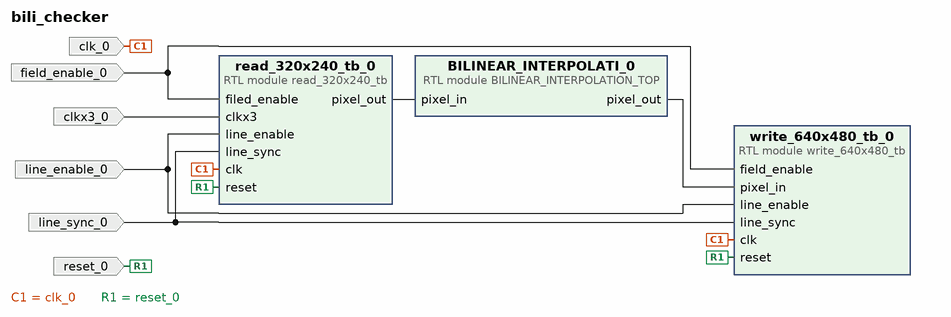
[diagram p0: block diagram of the top level]
# Vivado block design bili_checker, xc7a100tcsg324-1, Vivado 2019.2
create_bd_design bili_checker

create_bd_port -dir I -type clk clk_0
create_bd_port -dir I -type rst reset_0
create_bd_port -dir I field_enable_0
create_bd_port -dir I line_enable_0
create_bd_port -dir I line_sync_0
create_bd_port -dir I clkx3_0

create_bd_cell -type module -reference read_320x240_tb read_320x240_tb_0
create_bd_cell -type module -reference write_640x480_tb write_640x480_tb_0
create_bd_cell -type module -reference BILINEAR_INTERPOLATION_TOP BILINEAR_INTERPOLATI_0

# ---- connections ----

connect_bd_net [get_bd_pins read_320x240_tb_0/pixel_out] [get_bd_pins BILINEAR_INTERPOLATI_0/pixel_in]
connect_bd_net [get_bd_pins BILINEAR_INTERPOLATI_0/pixel_out] [get_bd_pins write_640x480_tb_0/pixel_in]
connect_bd_net -net clk_0_1 [get_bd_ports clk_0] [get_bd_pins write_640x480_tb_0/clk] [get_bd_pins read_320x240_tb_0/clk]
connect_bd_net -net reset_0_1 [get_bd_ports reset_0] [get_bd_pins write_640x480_tb_0/reset] [get_bd_pins read_320x240_tb_0/reset]
connect_bd_net -net field_enable_0_1 [get_bd_ports field_enable_0] \
  [get_bd_pins write_640x480_tb_0/field_enable] [get_bd_pins read_320x240_tb_0/filed_enable]
connect_bd_net -net line_enable_0_1 [get_bd_ports line_enable_0] \
  [get_bd_pins write_640x480_tb_0/line_enable] [get_bd_pins read_320x240_tb_0/line_enable]
connect_bd_net -net line_sync_0_1 [get_bd_ports line_sync_0] [get_bd_pins read_320x240_tb_0/line_sync] [get_bd_pins write_640x480_tb_0/line_sync]
connect_bd_net -net clkx3_0_1 [get_bd_ports clkx3_0] [get_bd_pins read_320x240_tb_0/clkx3]

validate_bd_design
save_bd_design
